# EAGLE design wireless_modul_board (EAGLE 7.3.0)
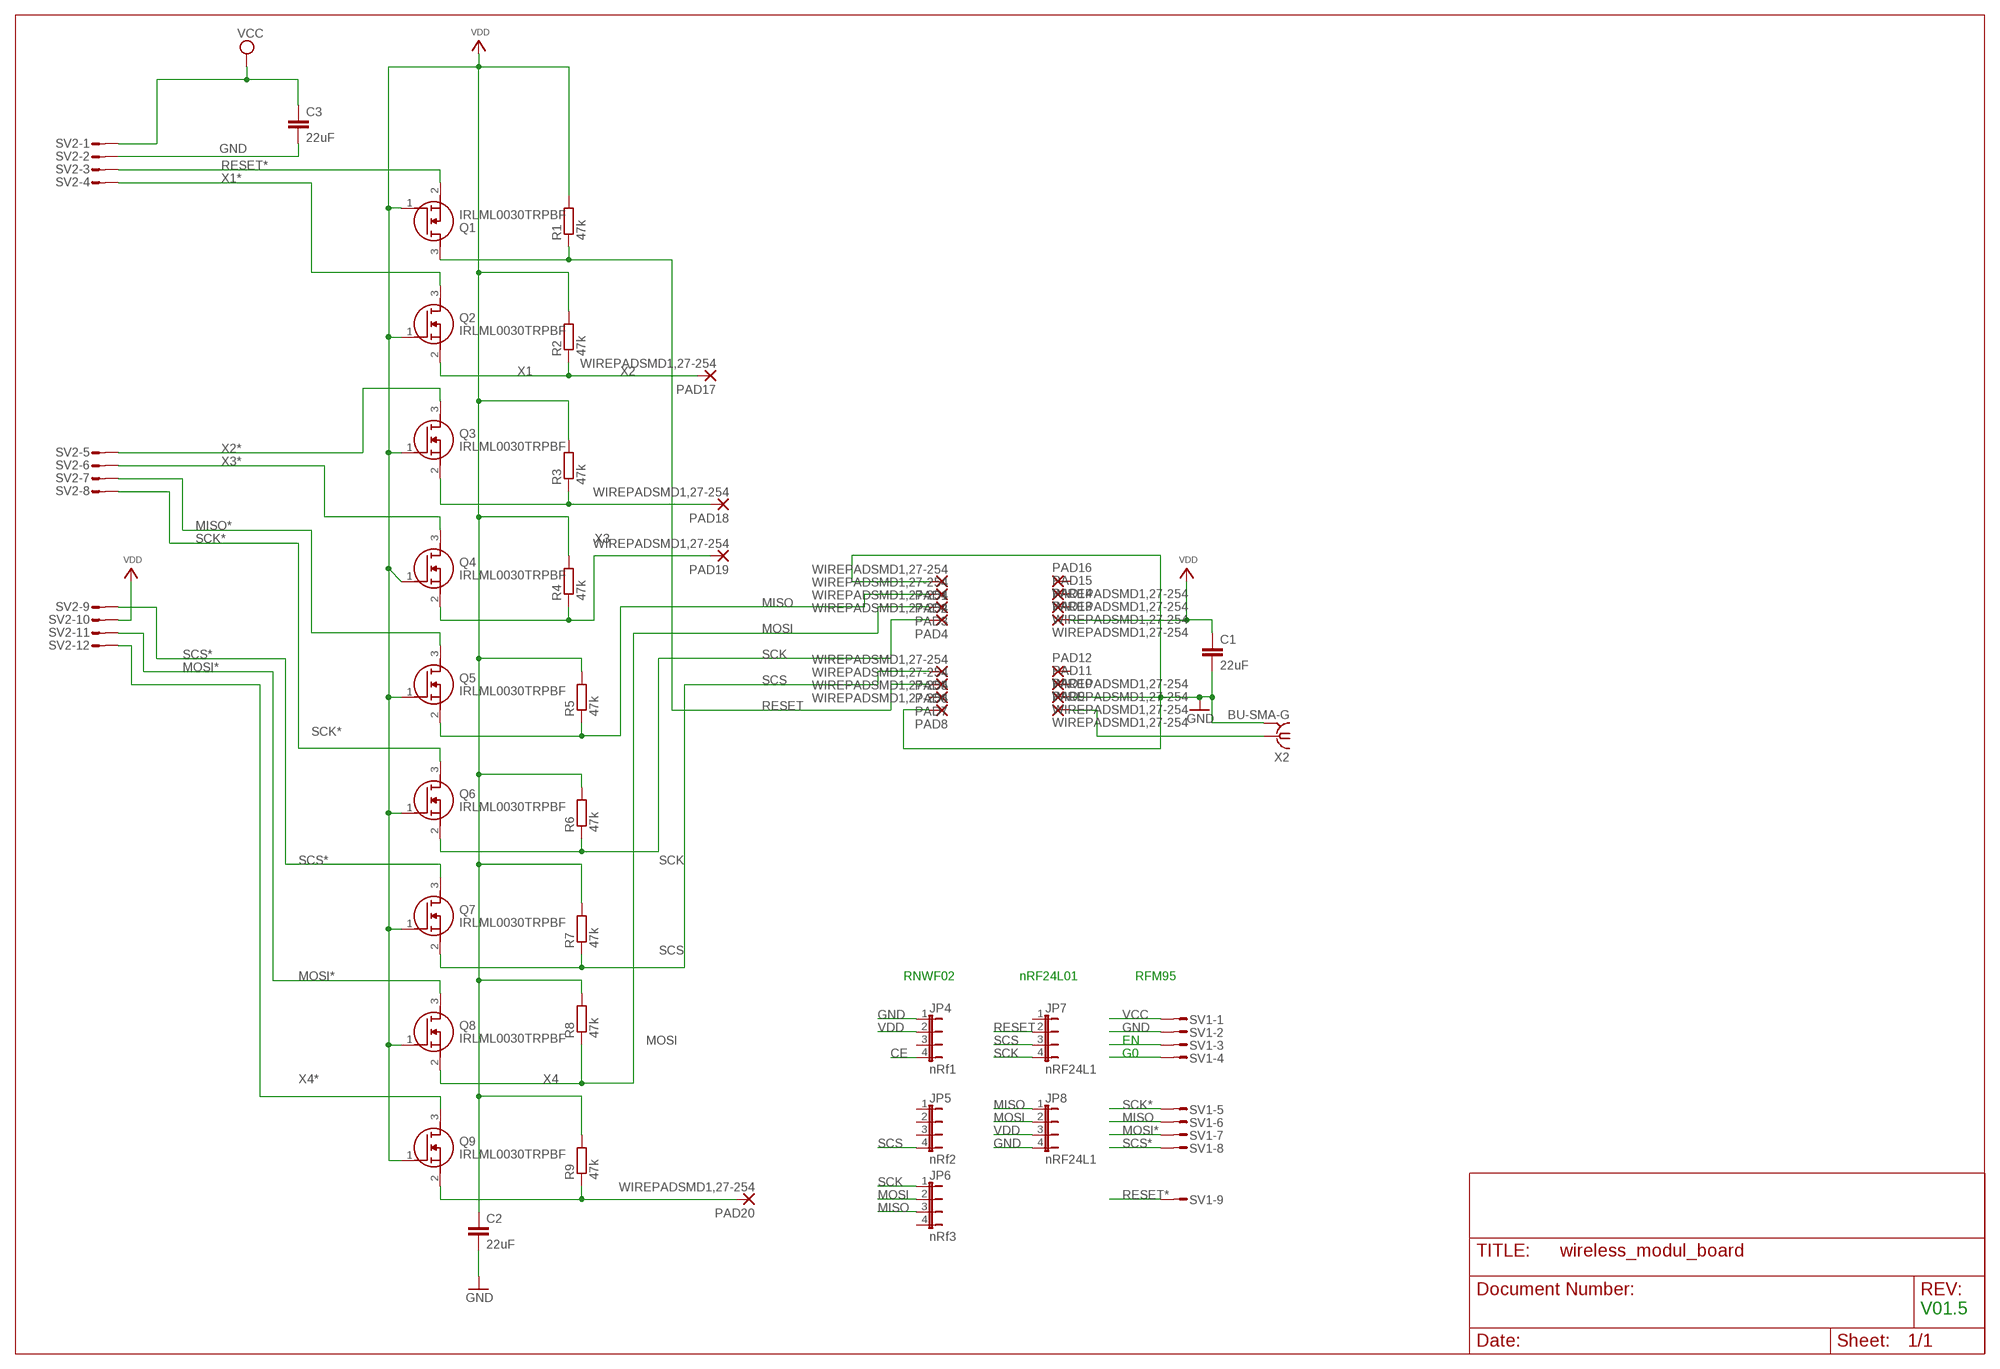
[diagram p0: schematic, sheet 1]

## Parts
C1  22uF  C-EUC1206  [C1206]
C2  22uF  C-EUC1206  [C1206]
C3  22uF  C-EUC1206  [C1206]
JP4  nRf1  JP4E  [JP4]
JP5  nRf2  JP4E  [JP4]
JP6  nRf3  JP4E  [JP4]
JP7  nRF24L1  JP4E  [JP4]
JP8  nRF24L1  JP4E  [JP4]
PAD1  WIREPADSMD1,27-254  [SMD1,27-2,54]
PAD2  WIREPADSMD1,27-254  [SMD1,27-2,54]
PAD3  WIREPADSMD1,27-254  [SMD1,27-2,54]
PAD4  WIREPADSMD1,27-254  [SMD1,27-2,54]
PAD5  WIREPADSMD1,27-254  [SMD1,27-2,54]
PAD6  WIREPADSMD1,27-254  [SMD1,27-2,54]
PAD7  WIREPADSMD1,27-254  [SMD1,27-2,54]
PAD8  WIREPADSMD1,27-254  [SMD1,27-2,54]
PAD9  WIREPADSMD1,27-254  [SMD1,27-2,54]
PAD10  WIREPADSMD1,27-254  [SMD1,27-2,54]
PAD11  WIREPADSMD1,27-254  [SMD1,27-2,54]
PAD12  WIREPADSMD1,27-254  [SMD1,27-2,54]
PAD13  WIREPADSMD1,27-254  [SMD1,27-2,54]
PAD14  WIREPADSMD1,27-254  [SMD1,27-2,54]
PAD15  WIREPADSMD1,27-254  [SMD1,27-2,54]
PAD16  WIREPADSMD1,27-254  [SMD1,27-2,54]
PAD17  WIREPADSMD1,27-254  [SMD1,27-2,54]
PAD18  WIREPADSMD1,27-254  [SMD1,27-2,54]
PAD19  WIREPADSMD1,27-254  [SMD1,27-2,54]
PAD20  WIREPADSMD1,27-254  [SMD1,27-2,54]
Q1  IRLML0030TRPBF  [SOT95P237X112-3N]
Q2  IRLML0030TRPBF  [SOT95P237X112-3N]
Q3  IRLML0030TRPBF  [SOT95P237X112-3N]
Q4  IRLML0030TRPBF  [SOT95P237X112-3N]
Q5  IRLML0030TRPBF  [SOT95P237X112-3N]
Q6  IRLML0030TRPBF  [SOT95P237X112-3N]
Q7  IRLML0030TRPBF  [SOT95P237X112-3N]
Q8  IRLML0030TRPBF  [SOT95P237X112-3N]
Q9  IRLML0030TRPBF  [SOT95P237X112-3N]
R1  47k  R-EU_R1206  [R1206]
R2  47k  R-EU_R1206  [R1206]
R3  47k  R-EU_R1206  [R1206]
R4  47k  R-EU_R1206  [R1206]
R5  47k  R-EU_R1206  [R1206]
R6  47k  R-EU_R1206  [R1206]
R7  47k  R-EU_R1206  [R1206]
R8  47k  R-EU_R1206  [R1206]
R9  47k  R-EU_R1206  [R1206]
SV1  S09P  [S09P]
SV2  S12P  [S12P]
X2  BU-SMA-G  [BU-SMA-G]

## Nets
CE: JP4.4
GND: C1.2 C2.2 C3.2 JP4.1 JP8.4 PAD1.1(P) PAD8.1(P) PAD10.1(P) SV1.2 SV2.2 X2.2 X2.3 X2.4 X2.5
MISO: JP6.3 JP8.1 PAD2.1(P) Q5.2(S) R5.1 SV1.6
MISO*: Q5.3(D) SV2.7
MOSI: JP6.2 JP8.2 PAD3.1(P) Q8.2(S) R8.1
MOSI*: Q8.3(D) SV1.7 SV2.11
N$1: PAD9.1(P) X2.1
N$22: SV1.3
N$23: SV1.4
RESET: JP7.2 PAD6.1(P) Q1.3(D) R1.1
RESET*: Q1.2(S) SV1.9 SV2.3
SCK: JP6.1 JP7.4 PAD4.1(P) Q6.2(S) R6.1
SCK*: Q6.3(D) SV1.5 SV2.8
SCS: JP5.4 JP7.3 PAD5.1(P) Q7.2(S) R7.1
SCS*: Q7.3(D) SV1.8 SV2.9
VCC: C3.1 SV1.1 SV2.1
VDD: C1.1 C2.1 JP4.2 JP8.3 PAD13.1(P) Q1.1(G) Q2.1(G) Q3.1(G) Q4.1(G) Q5.1(G) Q6.1(G) Q7.1(G) Q8.1(G) Q9.1(G) R1.2 R2.2 R3.2 R4.2 R5.2 R6.2 R7.2 R8.2 R9.2 SV2.10
X1: PAD17.1(P) Q2.2(S) R2.1
X1*: Q2.3(D) SV2.4
X2: PAD18.1(P) Q3.2(S) R3.1
X2*: Q3.3(D) SV2.5
X3: PAD19.1(P) Q4.2(S) R4.1
X3*: Q4.3(D) SV2.6
X4: PAD20.1(P) Q9.2(S) R9.1
X4*: Q9.3(D) SV2.12
Unconnected: JP4.3 JP5.1 JP5.2 JP5.3 JP6.4 JP7.1 PAD7.1(P) PAD11.1(P) PAD12.1(P) PAD14.1(P) PAD15.1(P) PAD16.1(P)

## Notes on the sheet
- RNWF02 | nRF24L01 | RFM95
- EN
- G0
- V01.5

## Library data of the parts
C1-C3 = rcl:C-EU: CAPACITOR, European symbol
JP4-JP8 = jumper:JP4E: JUMPER
PAD1-PAD20 = wirepad:WIREPAD: Wire PAD connect wire on PCB
Q1-Q9 = IRLML0030TRPBF:IRLML0030TRPBF: INTERNATIONAL RECTIFIER - IRLML0030TRPBF - MOSFET, N CH, 30V, 5.3A, SOT23-3 Source: Datasheet <https://componentsearchengine.com/Datasheets/2/IRLML0030TRPBF.pdf>; AVAILABILITY: Unavailable; DESCRIPTION: RoHS Compliant | Low RDS(on) | Industry-Standard Pinout | Compatible with Existing Surface Mount Techniques | Qualified Industrial | Qualified MSL1 | SOT-23 Footprint; MF: Infineon Technologies; MP: IRLML0030TRPBF; PACKAGE: SOT-23-3 Infineon; PRICE: None
R1-R9 = resistor:R-EU_: RESISTOR, European symbol
SV1 = con-amp-mt:S09P: AMP MT CONNECTOR; OC_FARNELL: unknown; OC_NEWARK: unknown
SV2 = con-amp-mt:S12P: AMP MT CONNECTOR; OC_FARNELL: unknown; OC_NEWARK: unknown
X2 = con-coax:BU-SMA-G: FEMALE SMA CONNECTOR Radiall distributor RS 193-9117; OC_FARNELL: unknown; OC_NEWARK: unknown

## Board
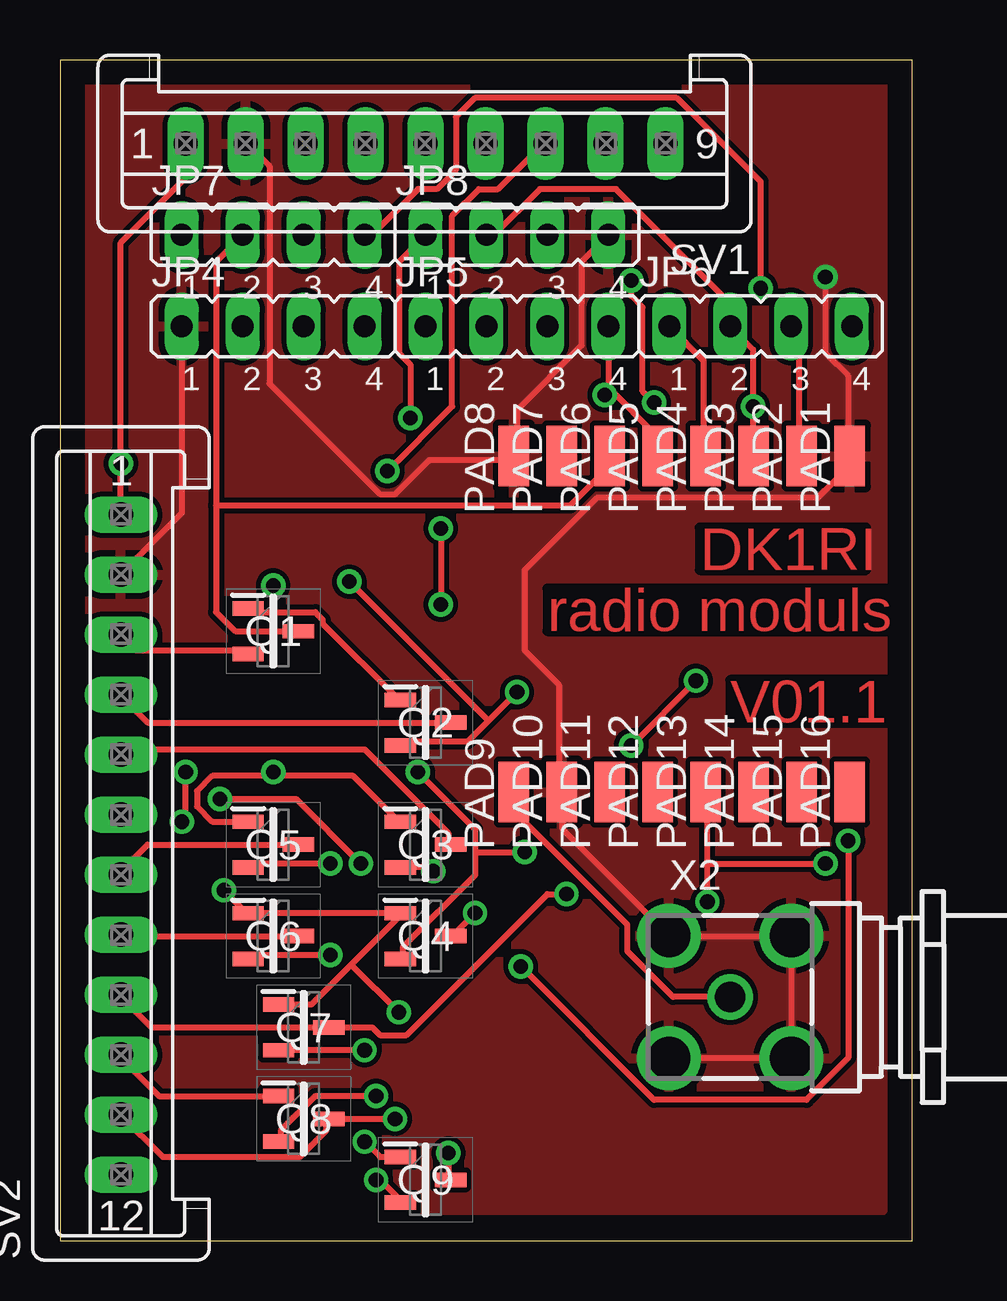
[diagram p1: board, top side]
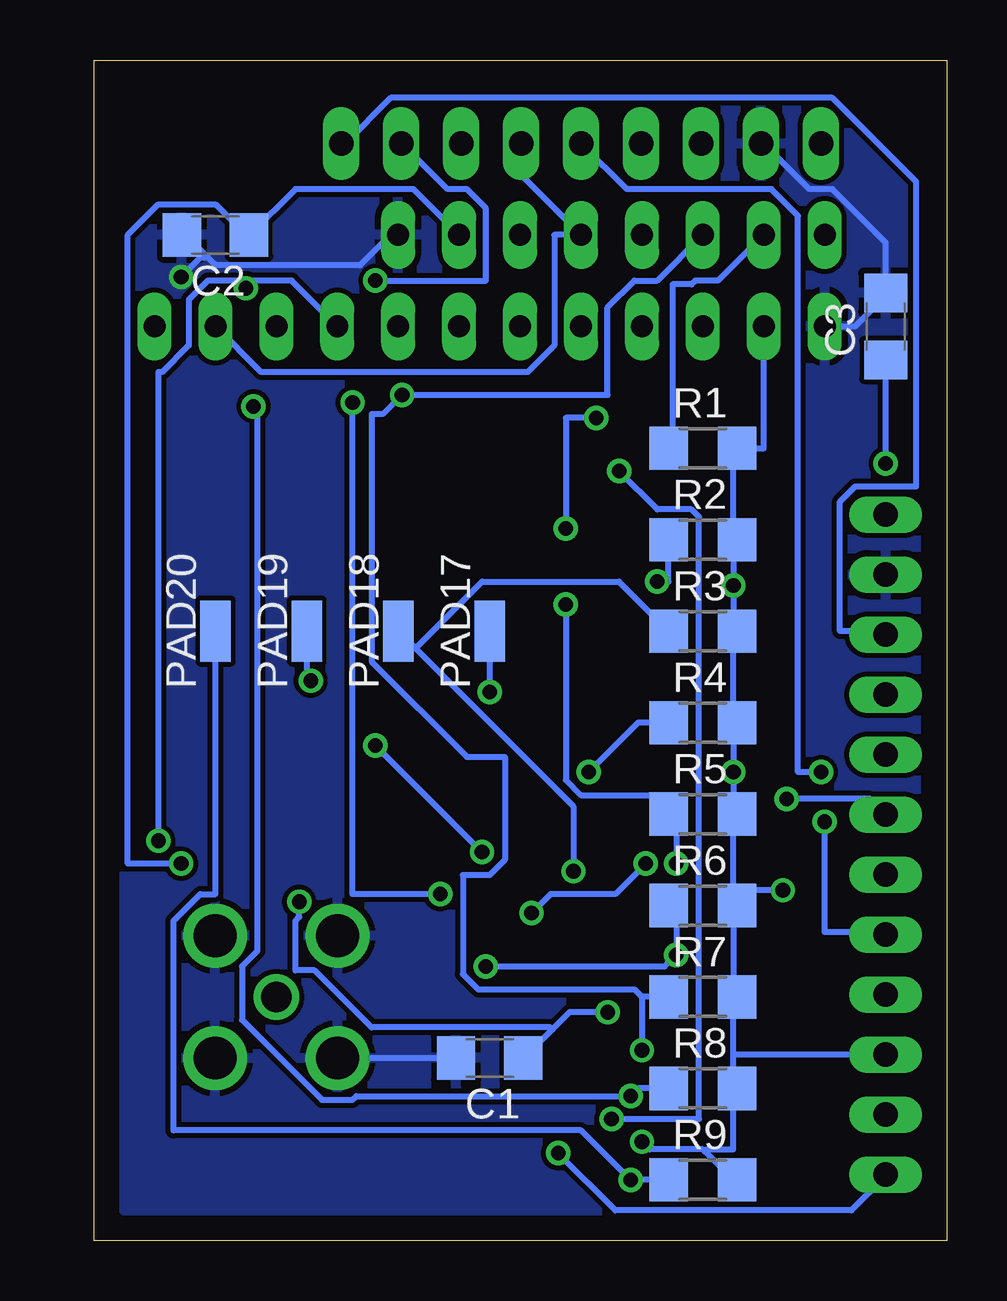
[diagram p2: board, bottom side, seen from below]

Size 35.54 x 49.2 mm. Coordinates in mm from the lower left corner, seen from the top.
Outline: 0,0 35.54,0 35.54,49.2 0,49.2 0,0
Copper layers (1*16): Top 0.035mm / dielectric 1.5mm / Bottom 0.035mm
Design rules "default": minimum track width 10mil, minimum drill 24mil, track to track 8mil, track to pad 8mil, pad to pad 8mil, via to via 8mil, smd to smd 8mil, copper to edge 40mil, drill to drill 8mil, minimum pad ring 10mil, minimum via ring 8mil, stop-mask expansion 4mil, vias tented up to drill 0mil, thermal gap 10mil

### Footprints (pad centres in the part's own frame; a part is rotated, then mirrored left to right if it is on the bottom)
C1206 = smd 1.6 x 1.8: 1 -1.4,0; 2 1.4,0
JP4 = drill 0.914 long: 1 -3.81,0; 2 -1.27,0; 3 1.27,0; 4 3.81,0
SMD1,27-2,54 = smd 1.27 x 2.54: 1 0,0
SOT95P237X112-3N = smd 1.3 x 0.6: 1 -1.05,0.95; 2 -1.05,-0.95; 3 1.05,0
R1206 = smd 1.6 x 1.803: 1 -1.422,0; 2 1.422,0
S09P = drill 1.016 long: 1 10,0; 2 7.5,0; 3 5,0; 4 2.5,0; 5 0,0; 6 -2.5,0; 7 -5,0; 8 -7.5,0; 9 -10,0
S12P = drill 1.016 long: 1 13.75,0; 2 11.25,0; 3 8.75,0; 4 6.25,0; 5 3.75,0; 6 1.25,0; 7 -1.25,0; 8 -3.75,0; 9 -6.25,0; 10 -8.75,0; 11 -11.25,0; 12 -13.75,0
BU-SMA-G = drill 1.27: 1 0,0 | drill 1.778: 2 -2.55,2.55; 3 2.55,2.55; 4 2.55,-2.55; 5 -2.55,-2.55

### Placement (x,y rotation side)
C1  19.05,7.62 180 bottom
C2  30.48,41.91 180 bottom
C3  2.54,38.1 90 bottom
JP4  8.89,38.1 0 top
JP5  19.05,38.1 0 top
JP6  29.21,38.1 0 top
JP7  8.89,41.91 0 top
JP8  19.05,41.91 0 top
PAD1  32.92,32.7 0 top
PAD2  30.92,32.7 0 top
PAD3  28.92,32.7 0 top
PAD4  26.92,32.7 0 top
PAD5  24.92,32.7 0 top
PAD6  22.92,32.7 0 top
PAD7  20.92,32.7 0 top
PAD8  18.92,32.7 0 top
PAD9  18.92,18.7 0 top
PAD10  20.92,18.7 0 top
PAD11  22.92,18.7 0 top
PAD12  24.92,18.7 0 top
PAD13  26.92,18.7 0 top
PAD14  28.92,18.7 0 top
PAD15  30.92,18.7 0 top
PAD16  32.92,18.7 0 top
PAD17  19.05,25.4 0 bottom
PAD18  22.86,25.4 0 bottom
PAD19  26.67,25.4 0 bottom
PAD20  30.48,25.4 0 bottom
Q1  8.89,25.4 0 top
Q2  15.24,21.59 0 top
Q3  15.24,16.51 0 top
Q4  15.24,12.7 0 top
Q5  8.89,16.51 0 top
Q6  8.89,12.7 0 top
Q7  10.16,8.89 0 top
Q8  10.16,5.08 0 top
Q9  15.24,2.54 0 top
R1  10.16,33.02 0 bottom
R2  10.16,29.21 0 bottom
R3  10.16,25.4 0 bottom
R4  10.16,21.59 0 bottom
R5  10.16,17.78 0 bottom
R6  10.16,13.97 0 bottom
R7  10.16,10.16 0 bottom
R8  10.16,6.35 0 bottom
R9  10.16,2.54 0 bottom
SV1  15.24,45.72 180 top
SV2  2.54,16.51 90 top
X2  27.94,10.16 0 top

### Tracks (layer width: path | path; a pad name or v marks a point on that pad's centre or on a via)
GND  (via drill 0.61)
  Top 0.254: X2.4 X2.5 | X2.3 X2.2 20.95,17.14 20.95,18.57 PAD10.1 20.8,18.73 20.8,23.18 19.37,24.61 19.37,27.94 22.38,30.96 31.59,30.96 32.86,32.23 32.86,32.54 PAD1.1 32.86,32.7 32.86,36.04 31.91,36.99 v31.91,40.16 | X2.3 X2.4 | X2.4 | X2.3 | JP8.4 21.75,40.8 21.75,37.31 19.05,34.61 19.05,32.7 PAD8.1 18.89,32.54 15.4,32.54 13.97,31.11 13.34,31.11 8.73,35.72 8.73,44.77 7.78,45.72 SV1.2 | JP4.1 5.08,30.32 2.54,27.78 SV2.2
  Bottom 0.254: C1.2 25.24,7.62 X2.5 | 30.88,41.04 30.48,40.64 24.45,40.64 23.18,41.91 JP8.4 | 30.88,41.04 31.75,41.91 C2.2 | v31.91,40.16 31.11,40.96 30.96,40.96 30.88,41.04 | JP4.1 3.81,38.1 2.54,39.37 C3.2 2.54,41.59 4.76,43.81 5.71,43.81 7.62,45.72 SV1.2
  pour Top: 1.27,48.26 34.29,48.26 34.29,1.27 1.27,1.27
  pour Bottom: 1.27,48.26 34.29,48.26 34.29,1.27 1.27,1.27
MISO  (via drill 0.61)
  Top 0.254: JP6.3 30.8,37.78 30.8,32.7 PAD2.1 | v11.27,15.72 7.94,15.72 Q5.2 | v15.88,29.69 v15.88,26.51 | v14.61,34.29 14.61,36.51 14.13,36.99 14.13,40.8 JP8.1
  Bottom 0.254: v11.27,15.72 11.27,17.78 R5.1 12.38,18.57 15.24,18.57 15.88,19.21 v15.88,26.51 | SV1.6 17.62,45.72 17.62,44.29 JP8.1 16.35,41.91 16.35,37.31 17.46,36.2 28.57,36.2 JP6.3 | v15.88,29.69 15.88,34.29 v14.61,34.29
MISO*
  Top 0.254: Q5.3 3.65,16.51 2.54,15.4 SV2.7
MOSI  (via drill 0.61)
  Top 0.254: v13.18,6.03 10.64,6.03 9.21,4.6 9.21,4.29 Q8.2 | PAD3.1 28.89,32.7 v28.89,34.77 28.89,37.15 JP6.2 27.94,39.05 23.18,43.81 20,43.81 18.1,41.91 JP8.2
  Bottom 0.254: R8.1 12.86,6.35 v13.18,6.03 24.61,6.03 24.77,5.87 26.04,5.87 29.37,9.21 29.37,11.43 28.73,12.06 28.73,34.77 v28.89,34.77
MOSI*  (via drill 0.61)
  Top 0.254: SV2.11 2.54,5.24 4.29,3.49 10,3.49 11.11,4.6 11.11,5.08 Q8.3 v13.97,5.08 | v13.65,32.07 16.35,34.77 16.35,42.7 17.46,43.81 18.26,43.81 20.16,45.72 SV1.7
  Bottom 0.254: v13.65,32.07 12.06,30.48 10.64,30.48 10.32,30.16 10.32,5.08 v13.97,5.08
N$1
  Top 0.254: X2.1 25.56,10.16 23.65,12.06 23.65,13.18 19.05,17.78 19.05,18.57 PAD9.1
RESET
  Top 0.254: Q1.3 7.3,25.4 6.51,26.19 6.51,30.64 | 6.51,30.64 6.51,40.8 JP7.2 | 6.51,30.64 21.27,30.64 22.86,32.23 22.86,32.54 PAD6.1
  Bottom 0.254: JP7.2 9.53,40.01 10.48,40.01 10.64,39.85 11.43,39.85 11.43,33.02 R1.1
RESET*
  Top 0.254: Q1.2 7.78,24.61 3.17,24.61 2.54,25.24 SV2.3
  Bottom 0.254: SV1.9 25.08,45.72 23.18,47.62 4.76,47.62 1.27,44.13 1.27,31.43 3.81,31.43 4.45,30.8 4.45,25.4 2.54,25.4 SV2.3
SCK  (via drill 0.61)
  Top 0.254: v11.27,11.91 7.94,11.91 Q6.2 | JP6.1 26.83,36.67 26.83,32.7 PAD4.1 | JP7.4 13.02,41.91 14.92,43.81 15.72,43.81 16.51,44.61 16.51,46.83 17.3,47.62 25.72,47.62 29.21,44.13 v29.21,39.69 | v19.21,11.43 24.77,5.87 31.11,5.87 32.86,7.62 v32.86,16.67
  Bottom 0.254: R6.1 11.27,13.97 v11.27,11.91 11.75,11.43 v19.21,11.43 | JP6.1 27.3,40.01 28.89,40.01 v29.21,39.69 29.05,40.01 30.8,40.01 31.59,39.21 31.59,37.31 32.7,36.2 32.86,36.2 v32.86,16.67
SCK*  (via drill 0.61)
  Top 0.254: Q6.3 2.54,12.7 SV2.8 | v5.24,19.53 5.24,17.62 v5.08,17.46
  Bottom 0.254: SV1.5 13.34,43.81 7.3,43.81 6.19,42.7 6.19,19.53 v5.24,19.53 | v5.08,17.46 5.08,12.86 2.54,12.86 SV2.8
SCS  (via drill 0.61)
  Top 0.254: v12.7,7.94 9.21,7.94 Q7.2 | 22.94,35.48 22.86,35.56 JP5.4 | 22.94,35.48 24.77,33.66 24.77,32.7 PAD5.1 | 22.94,35.48 v22.7,35.24
  Bottom 0.254: 12.7,10.16 v12.7,7.94 | R7.1 12.7,10.16 | JP7.3 12.06,40.01 13.02,40.01 14.13,38.89 14.13,35.24 v22.7,35.24 23.5,34.45 23.97,34.45 23.97,24.13 20,20.16 18.41,20.16 18.41,15.88 19.05,15.24 20.16,15.24 20.16,11.11 19.53,10.48 13.02,10.48 12.7,10.16
SCS*  (via drill 0.61)
  Top 0.254: SV2.9 2.54,10.16 3.81,8.89 Q7.3 13.02,8.89 13.34,8.57 14.45,8.57 20.32,14.45 v21.11,14.45 | v23.81,40.01 23.81,39.37 24.29,38.89 24.29,35.4 v24.77,34.92
  Bottom 0.254: v23.81,40.01 19.21,40.01 19.21,43.02 20,43.81 20.8,43.81 22.7,45.72 SV1.8 | v24.77,34.92 24.77,14.45 v21.11,14.45
VCC  (via drill 0.61)
  Top 0.254: SV2.1 v2.54,32.38 2.54,41.59 5.24,44.29 SV1.1
  Bottom 0.254: v2.54,32.38 C3.1
VDD  (via drill 0.61)
  Top 0.254: 8.89,26.19 7.94,26.19 Q1.1 | 8.89,26.19 10.64,26.19 10.95,25.88 10.95,25.72 14.13,22.54 Q2.1 | v8.89,27.3 8.89,26.19 | Q8.1 9.05,6.03 4.13,6.03 2.54,7.62 SV2.10 | 8.89,19.37 12.22,19.37 14.13,17.46 Q3.1 | 8.89,19.37 6.35,19.37 5.71,18.73 5.71,18.1 6.35,17.46 7.78,17.46 Q5.1 | v12.7,4.13 13.34,3.49 14.13,3.49 Q9.1 | v8.89,19.53 8.89,19.37 | 12.14,11.51 14.13,13.49 Q4.1 14.13,13.65 7.94,13.65 Q6.1 7.78,13.65 v6.83,14.61 | 12.14,11.51 10.48,9.84 9.21,9.84 Q7.1 | 12.14,11.51 v14.13,9.53 | v26.99,14.13 26.99,15.72 | 26.99,15.72 26.99,18.57 PAD13.1 | 26.99,15.72 v31.91,15.72
  Bottom 0.254: 8.89,29.21 v8.89,27.3 8.89,25.4 | 8.89,29.21 8.89,33.02 R1.2 7.62,33.02 JP4.2 | 8.89,29.21 R2.2 | 8.89,21.59 v8.89,19.53 8.89,17.78 | 8.89,13.97 8.89,10.16 | v12.7,4.13 12.38,3.81 10.16,3.81 10.08,3.73 | 10.08,3.73 8.89,2.54 R9.2 | 8.89,6.35 8.89,3.81 10,3.81 10.08,3.73 | 8.89,6.35 8.89,7.78 | 8.89,7.78 8.89,10.16 | 8.89,10.16 R7.2 | 8.89,6.35 R8.2 | 8.89,13.97 8.89,14.61 | 8.89,14.61 8.89,17.78 | 8.89,17.78 R5.2 | 8.89,13.97 R6.2 8.89,14.61 | 8.89,7.78 2.54,7.78 SV2.10 | 8.89,21.59 8.89,25.4 | 8.89,25.4 R3.2 | 8.89,21.59 R4.2 | JP8.3 22.23,43.81 27.15,43.81 29.05,41.91 C2.1 29.21,41.91 30.48,43.18 32.86,43.18 34.13,41.91 34.13,15.72 v31.91,15.72 | 16.43,8.81 15.72,9.53 v14.13,9.53 | 16.43,8.81 17.62,7.62 C1.1 | v26.99,14.13 26.99,13.49 27.15,13.34 27.15,11.27 26.35,11.27 23.97,8.89 16.51,8.89 16.43,8.81 | v6.83,14.61 8.89,14.61
X1  (via drill 0.61)
  Top 0.254: v19.05,22.86 17.86,21.67 | 17.86,21.67 16.99,20.8 14.29,20.8 Q2.2 | 17.86,21.67 v12.06,27.46
  Bottom 0.254: PAD17.1 v19.05,22.86 | v12.06,27.46 11.59,27.46 R2.1
X1*
  Top 0.254: Q2.3 3.65,21.59 2.54,22.7 SV2.4
X2  (via drill 0.61)
  Top 0.254: v15.56,15.4 15.4,15.56 14.29,15.56 Q3.2
  Bottom 0.254: v15.56,15.4 15.56,18.1 22.15,24.69 | PAD18.1 22.15,24.69 | 22.15,24.69 19.37,27.46 13.65,27.46 R3.1
X2*
  Top 0.254: Q3.3 16.19,16.51 16.19,16.99 12.7,20.48 2.7,20.48 2.54,20.32 SV2.5
X3  (via drill 0.61)
  Top 0.254: 17.3,16.19 17.3,17.14 v14.92,19.53 | 17.3,16.19 17.3,15.24 14.29,12.22 14.29,11.91 Q4.2 | v23.81,20.64 v26.51,23.34 | 17.3,16.19 v19.37,16.19
  Bottom 0.254: v14.92,19.53 12.86,21.59 R4.1 | PAD19.1 26.67,23.34 v26.51,23.34 | v19.37,16.19 v23.81,20.64
X3*  (via drill 0.61)
  Top 0.254: v17.3,13.65 16.35,12.7 Q4.3 | v12.54,15.72 9.84,18.41 v6.67,18.41
  Bottom 0.254: v17.3,13.65 16.51,14.45 13.81,14.45 v12.54,15.72 | v6.67,18.41 3.17,18.41 2.54,17.78 SV2.6
X4  (via drill 0.61)
  Top 0.254: v13.18,2.54 13.34,2.54 14.13,1.75 Q9.2
  Bottom 0.254: R9.1 v13.18,2.54 15.24,4.6 32.23,4.6 32.23,13.34 31.11,14.45 30.48,14.45 PAD20.1
X4*  (via drill 0.61)
  Top 0.254: v16.19,3.65 16.19,2.54 Q9.3
  Bottom 0.254: v16.19,3.65 13.81,1.27 3.97,1.27 2.54,2.7 SV2.12

### Text on the board
Top: DK1RI | radio moduls | V01.1